# EAGLE design hackeeg-connector-8 (EAGLE 9.1.2)
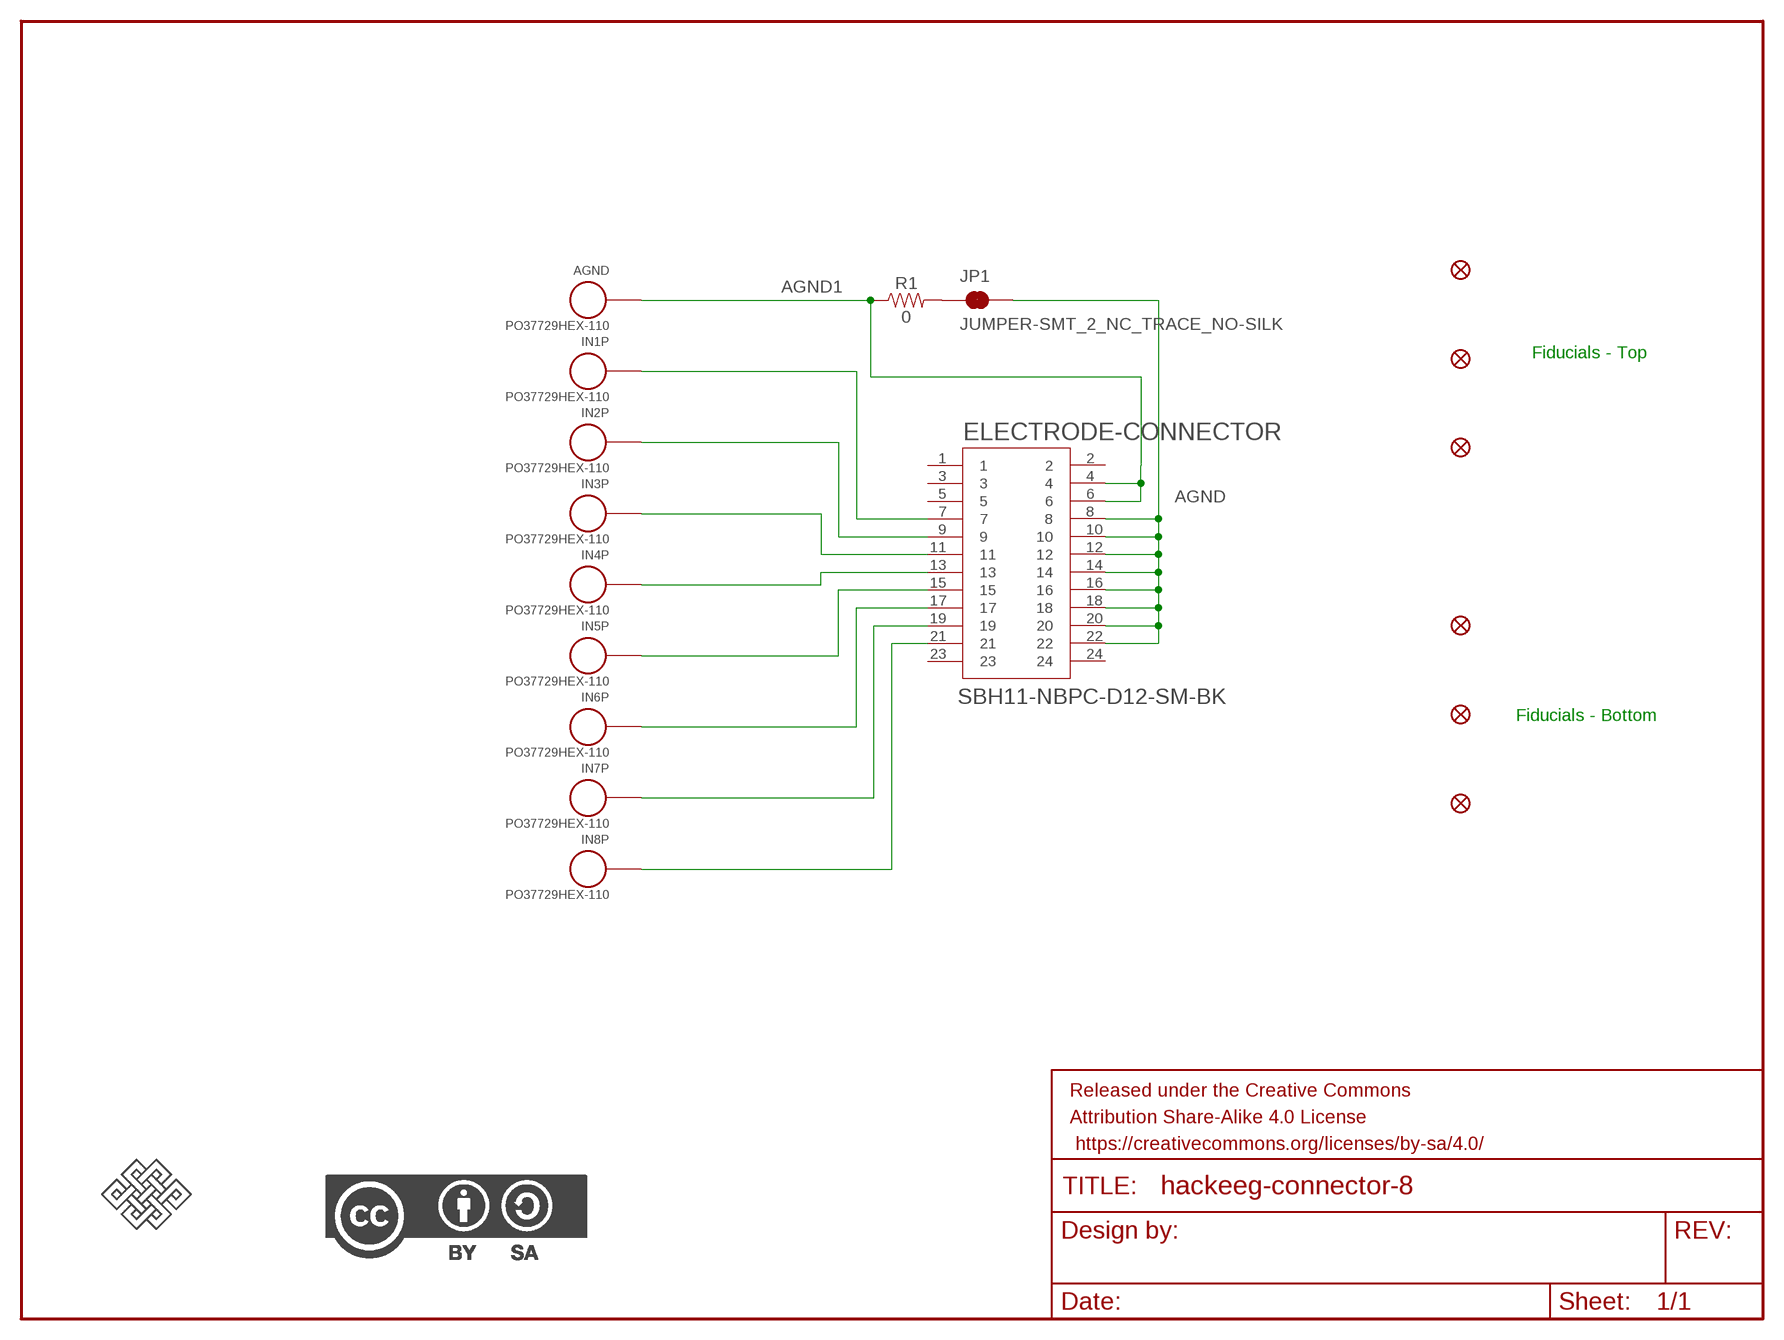
[diagram p0: schematic, sheet 1]

## Parts
AGND  PO37729HEX-110  [HEX-110]
ELECTRODE-CONNECTOR  SBH11-NBPC-D12-SM-BK  [SULLINS_SBH11-NBPC-D12-SM-BK]
FD1  FIDUCIAL1X2  [FIDUCIAL-1X2]
FD2  FIDUCIAL1X2  [FIDUCIAL-1X2]
FD3  FIDUCIAL1X2  [FIDUCIAL-1X2]
FD4  FIDUCIAL1X2  [FIDUCIAL-1X2]
FD5  FIDUCIAL1X2  [FIDUCIAL-1X2]
FD6  FIDUCIAL1X2  [FIDUCIAL-1X2]
FRAME1  FRAME-LETTER  [CREATIVE_COMMONS]
IN1P  PO37729HEX-110  [HEX-110]
IN2P  PO37729HEX-110  [HEX-110]
IN3P  PO37729HEX-110  [HEX-110]
IN4P  PO37729HEX-110  [HEX-110]
IN5P  PO37729HEX-110  [HEX-110]
IN6P  PO37729HEX-110  [HEX-110]
IN7P  PO37729HEX-110  [HEX-110]
IN8P  PO37729HEX-110  [HEX-110]
JP1  JUMPER-SMT_2_NC_TRACE_NO-SILK  [SMT-JUMPER_2_NC_TRACE_NO-SILK]
R1  0  0OHM-0603-1/10W-5%  [0603]
U$1  ENDLESSKNOTENDLESSKNOT-MEDIUM  [ENDLESSKNOT-MEDIUM]
U$13  CC-BY-SA  [CC-BY-SA]

## Nets
AGND: ELECTRODE-CONNECTOR.8 ELECTRODE-CONNECTOR.10 ELECTRODE-CONNECTOR.12 ELECTRODE-CONNECTOR.14 ELECTRODE-CONNECTOR.16 ELECTRODE-CONNECTOR.18 ELECTRODE-CONNECTOR.20 ELECTRODE-CONNECTOR.22 JP1.2
AGND1: AGND.SIGNAL ELECTRODE-CONNECTOR.4 ELECTRODE-CONNECTOR.6 R1.1
N$2: ELECTRODE-CONNECTOR.7 IN1P.SIGNAL
N$3: ELECTRODE-CONNECTOR.9 IN2P.SIGNAL
N$4: ELECTRODE-CONNECTOR.11 IN3P.SIGNAL
N$5: ELECTRODE-CONNECTOR.13 IN4P.SIGNAL
N$6: ELECTRODE-CONNECTOR.15 IN5P.SIGNAL
N$7: ELECTRODE-CONNECTOR.17 IN6P.SIGNAL
N$8: ELECTRODE-CONNECTOR.19 IN7P.SIGNAL
N$9: ELECTRODE-CONNECTOR.21 IN8P.SIGNAL
N$17: JP1.1 R1.2
Unconnected: ELECTRODE-CONNECTOR.1 ELECTRODE-CONNECTOR.2 ELECTRODE-CONNECTOR.3 ELECTRODE-CONNECTOR.5 ELECTRODE-CONNECTOR.23 ELECTRODE-CONNECTOR.24

## Notes on the sheet
- Fiducials - Top
- Fiducials - Bottom

## Library data of the parts
AGND IN1P IN2P IN3P IN4P IN5P IN6P IN7P IN8P = po-37729:PO37729: Plastics One 37729 - DIN 42-802 female vertical jack
ELECTRODE-CONNECTOR = SBH11-NBPC-D12-SM-BK:SBH11-NBPC-D12-SM-BK: Conn Headr 2.54mm 24pos Gold Smd; AVAILABILITY: Warning; DESCRIPTION: Conn Headr 2.54mm 24pos Gold Smd; MF: Sullins Connector; MP: SBH11-NBPC-D12-SM-BK; PACKAGE: None; PRICE: 1.05 USD
FD1-FD6 = SparkFun-Aesthetics:FIDUCIAL: Fiducial Alignment Points Point-of-reference for pick-and-place machines and other optical instruments.
FRAME1 = SparkFun-Aesthetics:FRAME-LETTER: Schematic Frame - Letter Standard 8.5x11 US Letter frame
JP1 = SparkFun-Jumpers:JUMPER-SMT_2_NC_TRACE: Normally closed trace jumper This jumper has a trace between two pads so it's normally closed (NC). Use a razor knife to open the connection. For best results follow the IPC guidelines for cutting traces: Cutout at least 0.063 mm (0.005 in). Remove all loose material to clean up the cut area. Seal the cut with an approved epoxy. Reapply solder to reclose the connection.
R1 = SparkFun-Resistors:0OHM: 0Ω resistor A resistor is a passive two-terminal electrical component that implements electrical resistance as a circuit element. Resistors act to reduce current flow, and, at the same time, act to lower voltage levels within circuits. - Wikipedia; PROD_ID: RES-08609
U$1 = endless-knot:ENDLESSKNOT
U$13 = creative-commons:CC-BY-SA: CC-BY-SA logo

## Board
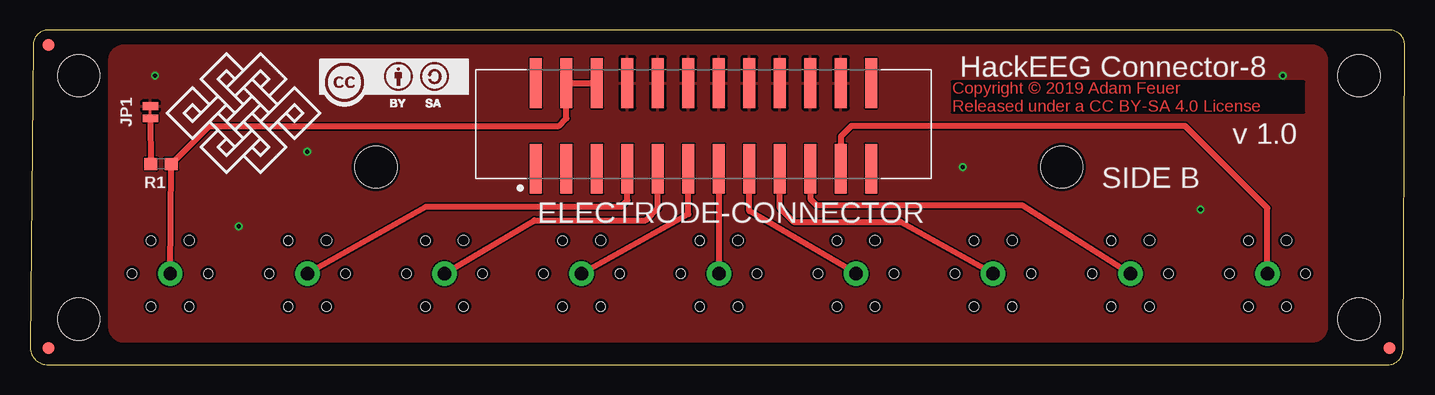
[diagram p1: board, top side]
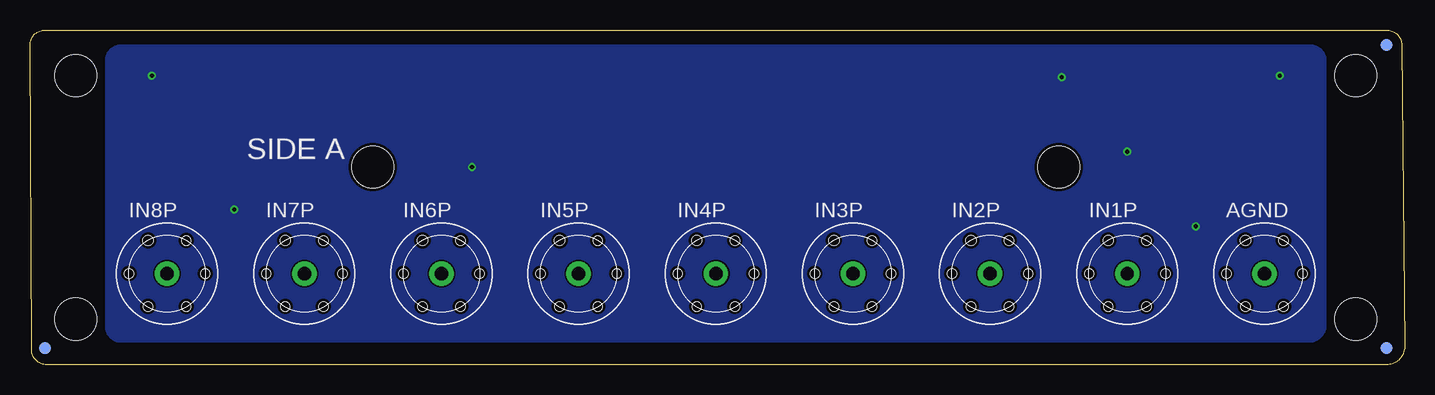
[diagram p2: board, bottom side, seen from below]

Size 114.55 x 27.94 mm. Coordinates in mm from the lower left corner, seen from the top.
Outline: 1.52,0 113.15,0 arc90 114.42,1.26 114.55,26.67 arc90 113.28,27.94 1.52,27.94 arc90 0.25,26.67 0,1.52 arc90 1.52,0
Copper layers (1*16): Top 0.035mm / dielectric 1.5mm / Bottom 0.035mm
Design rules "MF_Standard_2_Layer": minimum track width 5mil, minimum drill 12mil, track to track 5mil, track to pad 5mil, pad to pad 5mil, via to via 5mil, smd to smd 0mil, copper to edge 10mil, drill to drill 10mil, minimum pad ring 6mil, minimum via ring 6mil, stop-mask expansion 2mil, vias tented up to drill 25mil, thermal gap 10mil
Holes 3.5 mm at 4.06,24.13 4.06,3.81 110.74,3.81 110.74,24.13 28.83,16.51 85.98,16.51

### Footprints (pad centres in the part's own frame; a part is rotated, then mirrored left to right if it is on the bottom)
HEX-110 = drill 1.118 pad 2.032: SIGNAL 0,0 | hole 0.762: -3.175,0; -1.587,-2.75; 1.587,2.75; 3.175,0; 1.587,-2.75 | hole 0.838: -1.587,2.75
SULLINS_SBH11-NBPC-D12-SM-BK = smd 1 x 4.15: 1 -13.97,-3.575; 2 -13.97,3.575; 3 -11.43,-3.575; 4 -11.43,3.575; 5 -8.89,-3.575; 6 -8.89,3.575; 7 -6.35,-3.575; 8 -6.35,3.575; 9 -3.81,-3.575; 10 -3.81,3.575; 11 -1.27,-3.575; 12 -1.27,3.575; 13 1.27,-3.575; 14 1.27,3.575; 15 3.81,-3.575; 16 3.81,3.575; 17 6.35,-3.575; 18 6.35,3.575; 19 8.89,-3.575; 20 8.89,3.575; 21 11.43,-3.575; 22 11.43,3.575; 23 13.97,-3.575; 24 13.97,3.575
FIDUCIAL-1X2 = smd 1 x 1: 1 0,0
SMT-JUMPER_2_NC_TRACE_NO-SILK = smd 0.635 x 1.27: 1 -0.508,0; 2 0.508,0
0603 = smd 1.1 x 1: 1 -0.85,0; 2 0.85,0

### Placement (x,y rotation side)
AGND  11.68,7.62 0 bottom
ELECTRODE-CONNECTOR  56.13,19.94 0 top
FD1  1.52,1.4 0 top
FD2  1.52,26.67 0 top
FD3  113.28,1.4 0 top
FD4  113.28,1.4 0 bottom
FD5  1.52,26.67 0 bottom
FD6  1.52,1.4 0 bottom
FRAME1  21.84,-12.7 0 top  (outside the outline)
IN1P  23.11,7.62 0 bottom
IN2P  34.54,7.62 0 bottom
IN3P  45.97,7.62 0 bottom
IN4P  57.4,7.62 0 bottom
IN5P  68.83,7.62 0 bottom
IN6P  80.26,7.62 0 bottom
IN7P  91.69,7.62 0 bottom
IN8P  103.12,7.62 0 bottom
JP1  10.03,21.08 90 top
R1  10.92,16.76 180 top
U$1  17.91,20.96 0 top
U$13  24,21.21 0 top

### Tracks (layer width: path | path; a pad name or v marks a point on that pad's centre or on a via)
AGND  (via drill 0.35)
  other vias: 23.11,17.78 10.41,24.13 17.4,11.56 77.72,16.51 97.54,12.95 104.39,24.13 28.58,24
  pour Top: 6.6,3.17 6.6,25.4 arc-90 7.87,26.67 106.81,26.67 arc-90 108.08,25.4 108.08,3.17 arc-90 106.81,1.91 7.87,1.91 arc-90
  pour Bottom: 6.6,24.13 6.6,10.16 6.6,3.3 arc90 8,1.91 9.91,1.91 106.93,1.91 arc90 108.2,3.17 108.2,8.76 108.2,25.4 arc90 106.93,26.67 105.03,26.67 7.87,26.67 arc90 6.6,25.4
AGND1
  Top 0.508: AGND.SIGNAL R1.1 14.95,19.94 44.07,19.94 44.7,20.57 ELECTRODE-CONNECTOR.4 ELECTRODE-CONNECTOR.6
N$2
  Top 0.508: IN1P.SIGNAL 33.02,13.21 49.28,13.21 49.78,13.72 ELECTRODE-CONNECTOR.7
N$3
  Top 0.508: IN2P.SIGNAL 42.04,12.07 51.31,12.07 52.32,13.08 ELECTRODE-CONNECTOR.9
N$4
  Top 0.508: IN3P.SIGNAL 54.86,12.57 ELECTRODE-CONNECTOR.11
N$5
  Top 0.508: ELECTRODE-CONNECTOR.13 IN4P.SIGNAL
N$6
  Top 0.508: IN5P.SIGNAL 59.94,12.83 ELECTRODE-CONNECTOR.15
N$7
  Top 0.508: ELECTRODE-CONNECTOR.17 62.48,13.08 63.63,11.94 72.55,11.94 IN6P.SIGNAL
N$8
  Top 0.508: ELECTRODE-CONNECTOR.19 65.02,13.84 65.53,13.34 82.68,13.34 IN7P.SIGNAL
N$9
  Top 0.508: ELECTRODE-CONNECTOR.21 67.56,19.05 68.45,19.94 96.27,19.94 103.12,13.08 IN8P.SIGNAL
N$17
  Top 0.508: JP1.1 R1.2

### Text on the board
Top: Copyright © 2019 Adam Feuer / Released under a CC BY-SA 4.0 License
tNames: HackEEG Connector-8 | v 1.0 | SIDE B
bNames: SIDE A